# EasyEDA Pro project Flexbus_Breakout.eprj

# Schematic Schematic1
Create Date: 2024-02-22; Page Name: P1; Project Name: Flexbus_Breakout; Schematic Name: Schematic1; Update Date: 2024-02-22; Company: EasyEDA.com; Drawn: EasyEDA; Page Size: A4; Part Number: JLCPCB-002; Reviewed: EasyEDA; Version: V0.1
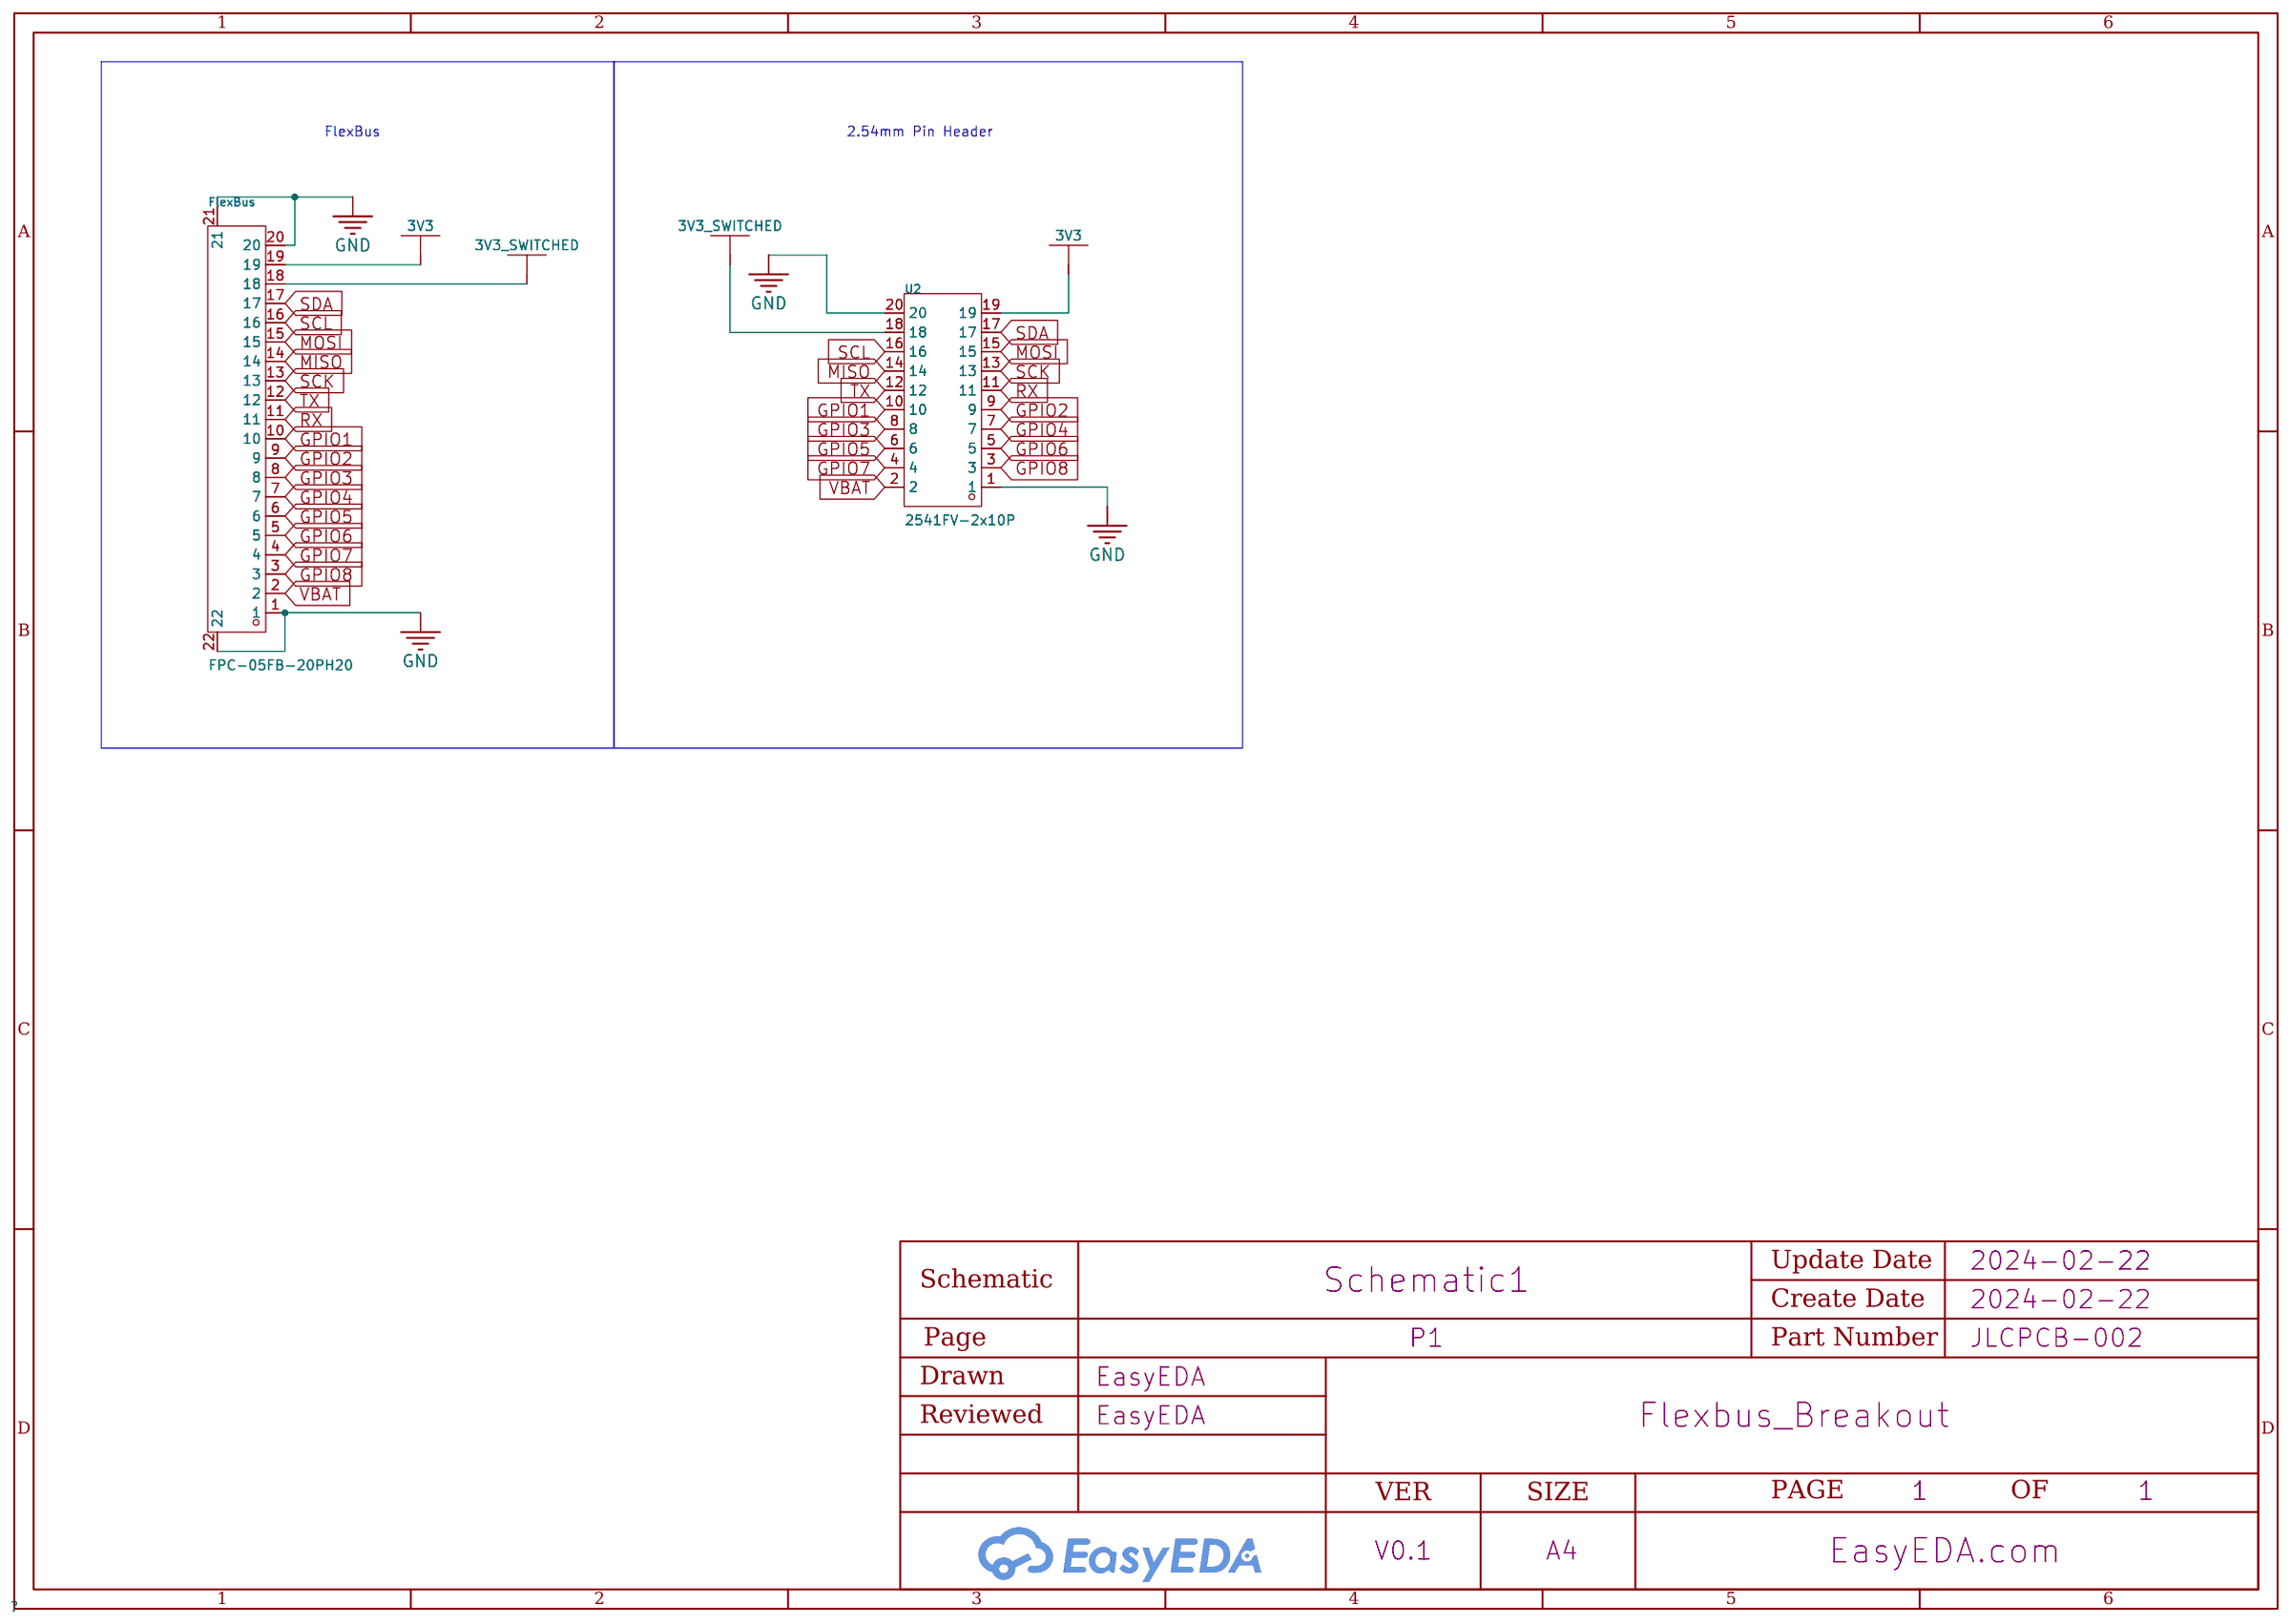
[diagram p0: schematic sheet]

## Parts
FlexBus  FPC-05FB-20PH20  [FPC-SMD_20P-P0.50_FPC-05FB-20PH20]
U2  2541FV-2x10P  [HDR-TH_20P-P2.54-V-F-R2-C10-S2.54]

## Library data of the parts
FlexBus = FPC-05FB-20PH20: Pitch:0.5mm Number of Contacts:20P Locking Feature:Clamshell FFC, FCB Thickness:0.3mm FFC, FCB Thickness:0.3mm Contact Type:Double-sided contacts/up and down connection Mounting Type:Surface Mount Height Above Board:2mm Operating Temperature Range:-25℃~+8; LCSC Part Name: 间距:0.5mm P数:20P 翻盖式 双侧触点/上下接; Supplier Part: C2856830; Manufacturer: XUNPU(讯普); Supplier Footprint: SMD,P=0.5mm,卧贴; JLCPCB Part Class: Extended Part; Datasheet: https://atta.szlcsc.com/upload/public/pdf/source/20210922/C2856830_32DC95BE77527398880E7D75F765EF2A.pdf; Supplier: LCSC; Pitch: 0.5mm; Number of Contacts: 20P; Locking Feature: Clamshell; FFC, FCB Thickness: 0.3mm; Contact Type: Double-sided contacts/up and down connection; Mounting Type: Surface Mount; Height Above Board: 2mm; Operating Temperature Range: -25℃~+85℃
U2 = 2541FV-2x10P: Holes Structure:2x10P Pitch:2.54mm Circular Hole / Square Hole:方孔 Mounting Type:Straight Number of Rows:双排 Number of Holes:20P Current Rating (Max):3A Voltage Rating (Max):250V Holes Direction:Top Operating Temperature Range:-40℃~+105℃ Operating Temperatu; LCSC Part Name: 间距:2.54mm 2x10P 直插; Supplier Part: C18722936; Manufacturer: HanElectricity(瀚源); Supplier Footprint: 插件,P=2.54mm; JLCPCB Part Class: Extended Part; Datasheet: https://atta.szlcsc.com/upload/public/pdf/source/20231018/348A30CBB18FAA04E40F2CE12A6EAA75.pdf; Supplier: LCSC; Holes Structure: 2x10P; Pitch: 2.54mm; Circular Hole / Square Hole: 方孔; Mounting Type: Straight; Number of Rows: 双排; Number of Holes: 20P; Current Rating (Max): 3A; Voltage Rating (Max): 250V; Holes Direction: Top; Operating Temperature Range: -40℃~+105℃

## Nets
3V3: FlexBus.19 U2.19
3V3_SWITCHED: FlexBus.18 U2.18
GND: FlexBus.1 FlexBus.20 FlexBus.21 FlexBus.22 U2.1 U2.20
VBAT: FlexBus.2 U2.2
GPIO1: FlexBus.10 U2.10
GPIO2: FlexBus.9 U2.9
GPIO3: FlexBus.8 U2.8
GPIO4: FlexBus.7 U2.7
GPIO5: FlexBus.6 U2.6
GPIO6: FlexBus.5 U2.5
GPIO7: FlexBus.4 U2.4
GPIO8: FlexBus.3 U2.3
MISO: FlexBus.14 U2.14
MOSI: FlexBus.15 U2.15
RX: FlexBus.11 U2.11
SCK: FlexBus.13 U2.13
SCL: FlexBus.16 U2.16
SDA: FlexBus.17 U2.17
TX: FlexBus.12 U2.12

## Notes on the sheet
- FlexBus
- 2.54mm Pin Header

# Board PCB1
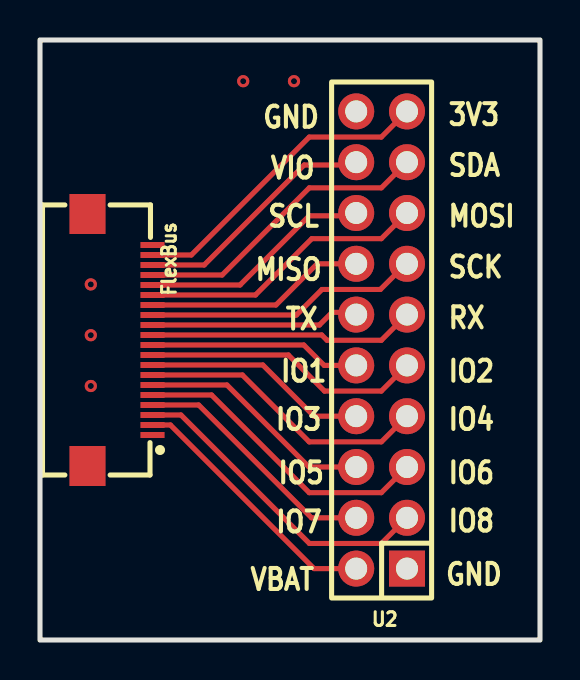
[diagram p1: board, top side]
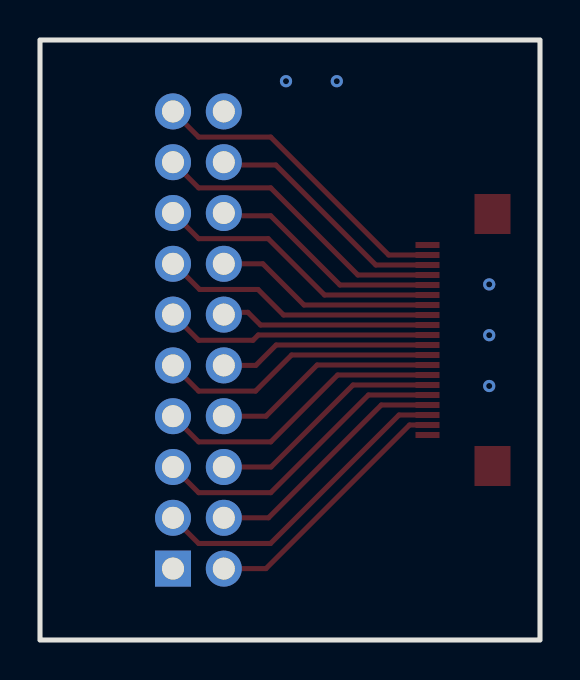
[diagram p2: board, bottom side, seen from below]

Outline 25 x 30 mm; copper layers: Top Layer, Bottom Layer. Coordinates in mm from the lower left corner of the outline.
Outline path: rectangle 0,30 25,0
Stack: Top Layer 0.035mm / Dielectric1 1.51mm FR4 er 4.5 / Bottom Layer 0.035mm

## Design rules (mm)
template: JLCPCB Capability(Two Layers Board)
spacing copperThickness1oz (default): track to track 0.102, other pairs 0.152 to 0.3
spacing copperThickness2oz: track to track 0.203, other pairs 0.152 to 0.3
track width copperThickness1oz (default): min 0.127, default 0.254, max 2.54
track width copperThickness2oz: min 0.203, default 0.254, max 2.54
differential pair differentialPair (default): width min 0.127, default 0.254, max 2.54; gap min 0.152, default 0.152
via viaSize (default): diameter min 0.5, default 0.61, max 10; hole min 0.3, default 0.305, max 6.3

## Placement (name value [footprint] x y rotation side)
FlexBus  FPC-05FB-20PH20  [FPC-SMD_20P-P0.50_FPC-05FB-20PH20]  4 15 270 top
U2  2541FV-2x10P  [HDR-TH_20P-P2.54-V-F-R2-C10-S2.54]  17.08 15 90 top

## Footprints (pads in the part's own frame, mm; a bottom-side part is the same pattern mirrored in y, then rotated)
FPC-SMD_20P-P0.50_FPC-05FB-20PH20
  rect 0.3x1.2 smd: 1(4.75,1.625) 2(4.25,1.625) 3(3.75,1.625) 4(3.25,1.625) 5(2.75,1.625) 6(2.25,1.625) 7(1.75,1.625) 8(1.25,1.625) 9(0.75,1.625) 10(0.25,1.625) 11(-0.25,1.625) 12(-0.75,1.625) 13(-1.25,1.625) 14(-1.75,1.625) 15(-2.25,1.625) 16(-2.75,1.625) 17(-3.25,1.625) 18(-3.75,1.625) 19(-4.25,1.625) 20(-4.75,1.625)
  rect 2x1.8 smd: 21(-6.3,-1.625) 22(6.3,-1.625)
HDR-TH_20P-P2.54-V-F-R2-C10-S2.54
  rect 1.8x1.8 hole 1.1: 1(-11.43,-1.27)
  round 1.8 hole 1.1: 2(-11.43,1.27) 3(-8.89,-1.27) 4(-8.89,1.27) 5(-6.35,-1.27) 6(-6.35,1.27) 7(-3.81,-1.27) 8(-3.81,1.27) 9(-1.27,-1.27) 10(-1.27,1.27) 11(1.27,-1.27) 12(1.27,1.27) 13(3.81,-1.27) 14(3.81,1.27) 15(6.35,-1.27) 16(6.35,1.27) 17(8.89,-1.27) 18(8.89,1.27) 19(11.43,-1.27) 20(11.43,1.27)

## Nets
As in the schematic.

## Via types
v1: diameter 0.61, hole 0.304, Top Layer to Bottom Layer, 5 vias

## Routing (per net, layer and track width the routed paths; a pad name or vN(x,y) marks a point on that pad's centre or on a via; arc(x,y) is an arc through that point)
3V3: length 15.7
  Top Layer w0.254: U2.19 17.07,25.15 13.46,25.15 7.57,19.25 FlexBus.19
3V3_SWITCHED: length 12.3
  Top Layer w0.254: U2.18 15.67,23.75 13.21,23.75 8.21,18.75 FlexBus.18
GND:
  vias: v1(2.54,17.78) v1(2.54,15.24) v1(2.54,12.7) v1(10.16,27.94) v1(12.7,27.94)
VBAT: length 13.2
  Top Layer w0.254: FlexBus.2 6.52,10.75 13.7,3.57 U2.2
GPIO1: length 10.6
  Top Layer w0.254: U2.10 14.21,13.73 13.19,14.75 FlexBus.10
GPIO2: length 14
  Top Layer w0.254: U2.9 17.07,12.45 14.22,12.45 12.42,14.25 FlexBus.9
GPIO3: length 11.2
  Top Layer w0.254: U2.8 13.7,11.19 11.14,13.75 FlexBus.8
GPIO4: length 14.6
  Top Layer w0.254: FlexBus.7 10.12,13.25 13.46,9.91 17.07,9.91 U2.7
GPIO5: length 11.9
  Top Layer w0.254: FlexBus.6 9.35,12.75 13.45,8.65 U2.6
GPIO6: length 15.3
  Top Layer w0.254: FlexBus.5 8.58,12.25 13.46,7.37 17.07,7.37 U2.5
GPIO7: length 12.5
  Top Layer w0.254: FlexBus.4 7.94,11.75 13.57,6.11 U2.4
GPIO8: length 15.9
  Top Layer w0.254: FlexBus.3 7.05,11.25 13.47,4.83 17.07,4.83 U2.3
MISO: length 11
  Top Layer w0.254: U2.14 13.86,18.81 11.8,16.75 FlexBus.14
MOSI: length 14.4
  Top Layer w0.254: FlexBus.15 10.77,17.25 13.59,20.07 17.07,20.07 U2.15
RX: length 13.4
  Top Layer w0.254: U2.11 17.07,14.99 14.35,14.99 14.09,15.25 FlexBus.11
SCK: length 13.9
  Top Layer w0.254: 18.3,18.81 17.02,17.53 14.1,17.53 12.82,16.25 5.5,16.25
SCL: length 11.7
  Top Layer w0.254: U2.16 15.67,21.21 13.46,21.21 10,17.75 FlexBus.16
SDA: length 15.1
  Top Layer w0.254: FlexBus.17 9.11,18.25 13.46,22.61 17.07,22.61 U2.17
TX: length 10.5
  Top Layer w0.254: U2.12 15.7,16.38 14.6,16.38 13.97,15.75 FlexBus.12

## Copper pours and planes (outline as drawn; the poured copper is in the pictures)
GND on Top Layer: 0,30 25,30 25,0 0,0
GND on Bottom Layer: -0.13,29.87 24.87,29.87 24.87,-0.13 -0.13,-0.13

## Text on the board
Top Silkscreen Layer: VBAT | MISO | GND | SCL | VIO | IO3 | IO7 | IO5 | IO1 | TX | 3V3 | SDA | MOSI | SCK | RX | IO2 | IO4 | IO6 | IO8
